# Altium schematic sheet Float_Receiver_PCB.SchDoc
size A3; SheetNumber: 1; SheetTotal: 1
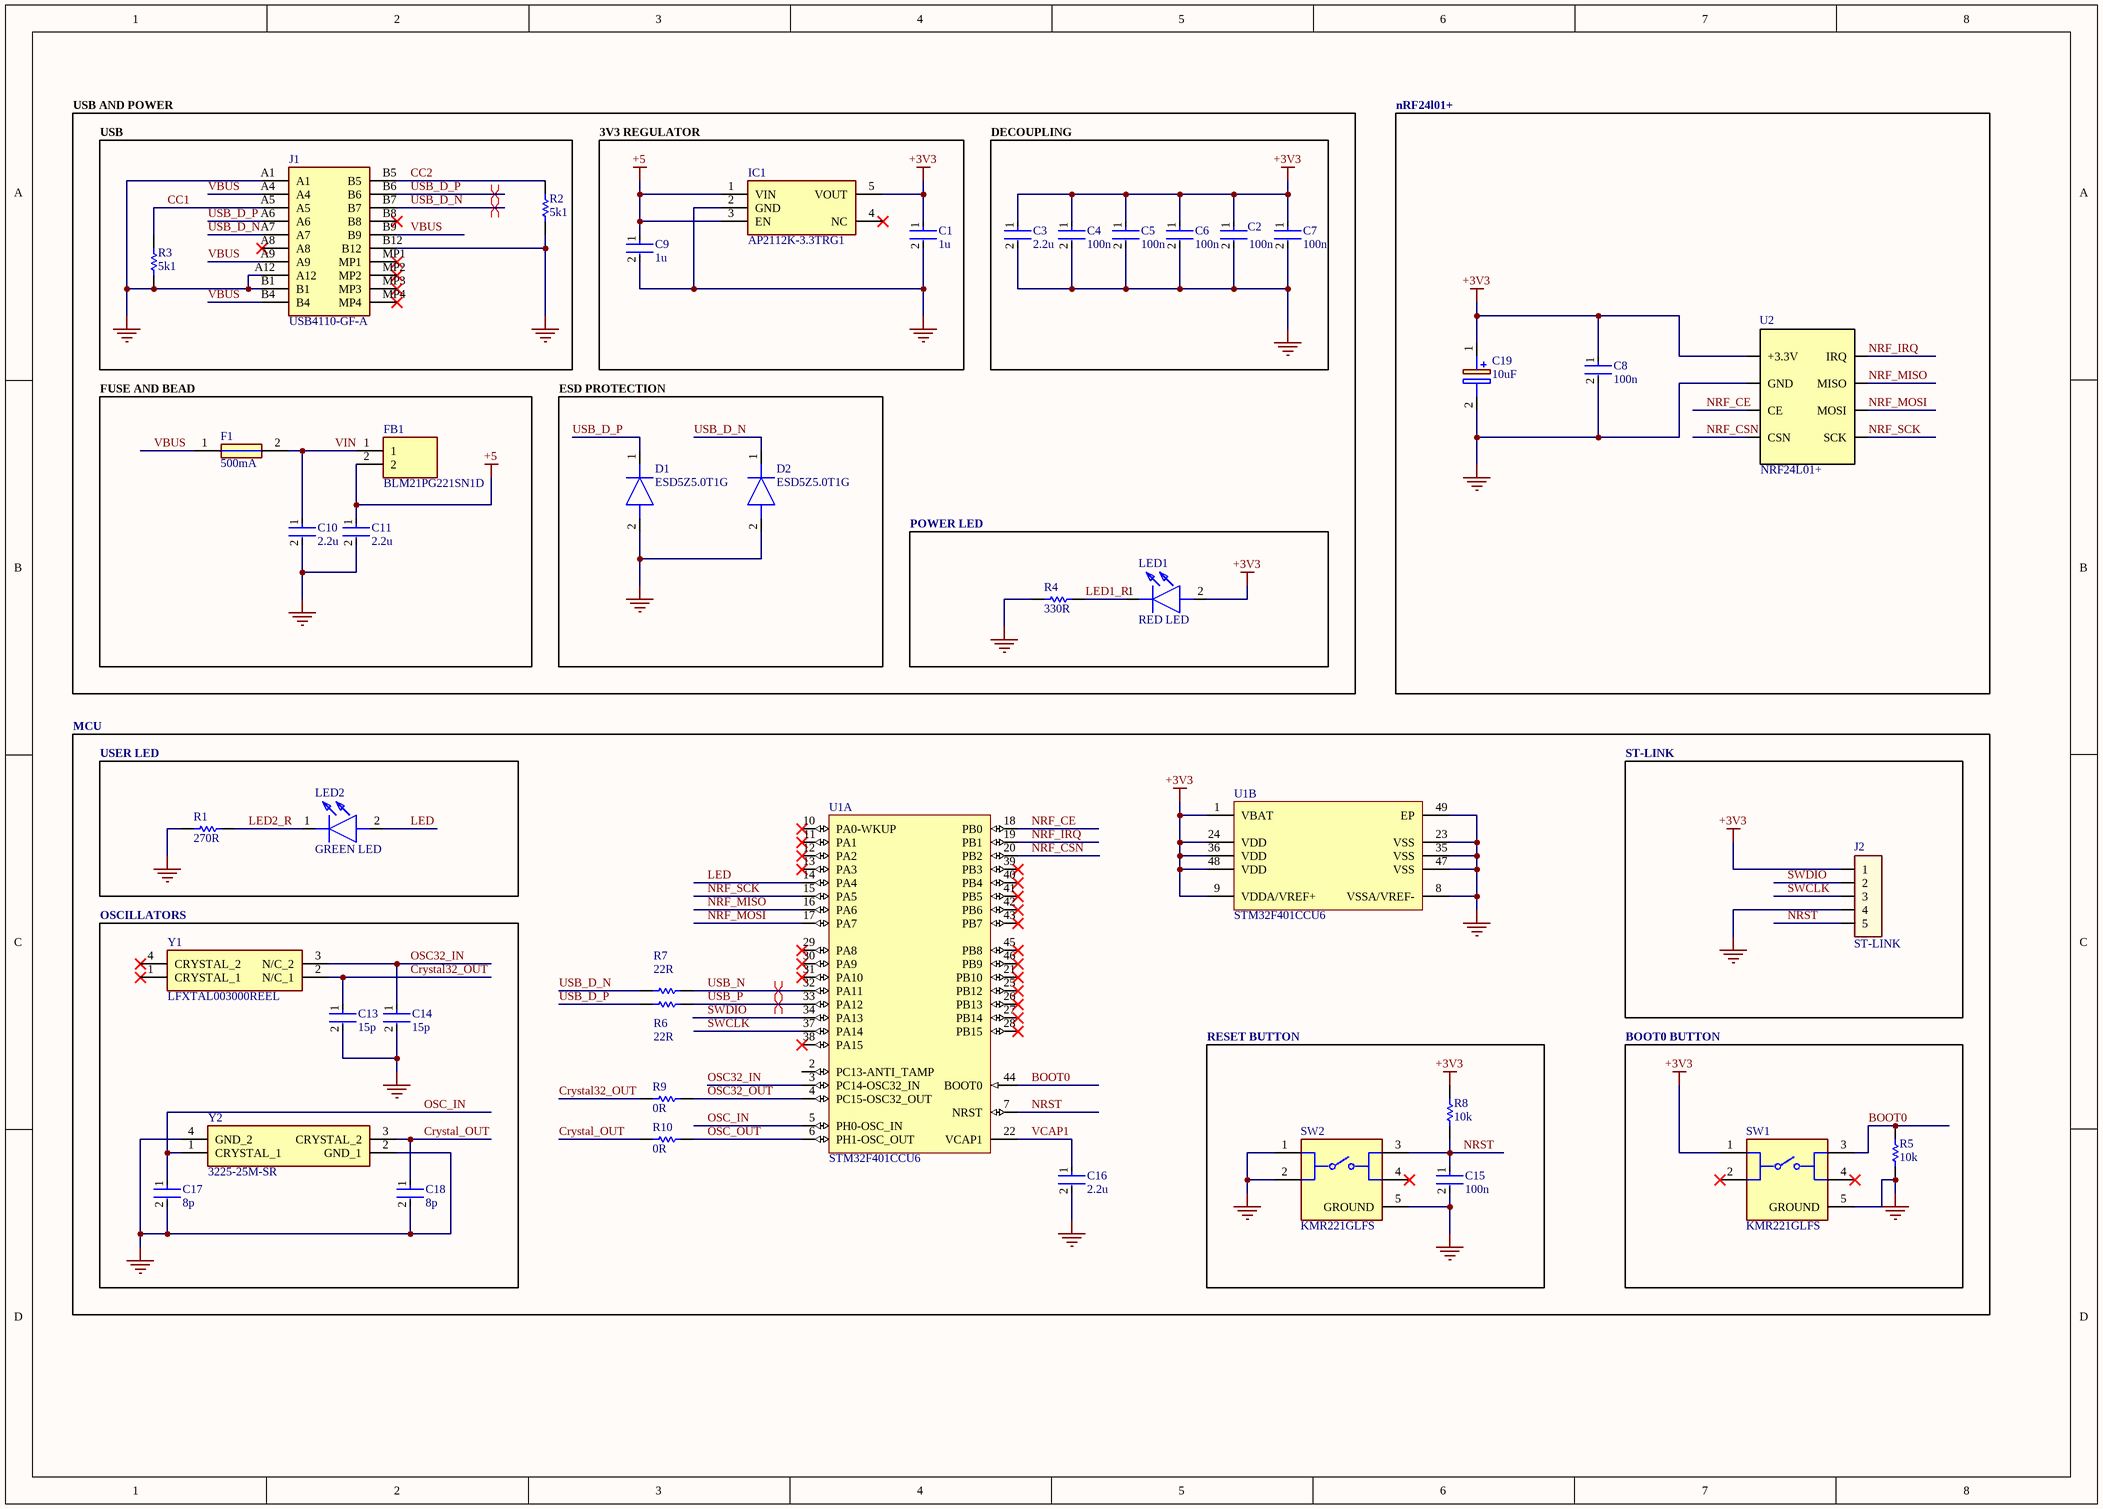
[diagram p0: Float_Receiver_PCB.SchDoc]

## Parts
C1  1u  [FP-0805-L_2_01_0_2-W_1_25-MFG]
C2  100n  [FP-0805-L_2_01_0_2-W_1_25-MFG]
C3  2.2u  [FP-0805-L_2_01_0_2-W_1_25-MFG]
C4  100n  [FP-0805-L_2_01_0_2-W_1_25-MFG]
C5  100n  [FP-0805-L_2_01_0_2-W_1_25-MFG]
C6  100n  [FP-0805-L_2_01_0_2-W_1_25-MFG]
C7  100n  [FP-0805-L_2_01_0_2-W_1_25-MFG]
C8  100n  [FP-0805-L_2_01_0_2-W_1_25-MFG]
C9  1u  [FP-0805-L_2_01_0_2-W_1_25-MFG]
C10  2.2u  [FP-0805-L_2_01_0_2-W_1_25-MFG]
C11  2.2u  [FP-0805-L_2_01_0_2-W_1_25-MFG]
C13  15p  [FP-0805-L_2_01_0_2-W_1_25-MFG]
C14  15p  [FP-0805-L_2_01_0_2-W_1_25-MFG]
C15  100n  [FP-0805-L_2_01_0_2-W_1_25-MFG]
C16  2.2u  [FP-0805-L_2_01_0_2-W_1_25-MFG]
C17  8p  [FP-0805-L_2_01_0_2-W_1_25-MFG]
C18  8p  [FP-0805-L_2_01_0_2-W_1_25-MFG]
C19  10uF  [EEE1AA220WR]
D1  ESD5Z5.0T1G  [SODFL1608X70N]
D2  ESD5Z5.0T1G  [SODFL1608X70N]
F1  500mA  [FUSC3216X75N]
FB1  BLM21PG221SN1D  [BEADC2012X105N]
IC1  AP2112K-3.3TRG1  [SOT95P285X140-5N]
J1  USB4110-GF-A  [USB4110GFA]
J2  ST-LINK  [goldpin5]
LED1  RED LED  [LEDC2012X80N]
LED2  GREEN LED  [LEDC2012X80N]
R1  270R  [RESC2013X60X35ML10T20]
R2  5k1  [RESC2013X60X35ML10T20]
R3  5k1  [RESC2013X60X35ML10T20]
R4  330R  [RESC2013X60X35ML10T20]
R5  10k  [RESC2013X60X35ML10T20]
R6  22R  [RESC2013X60X35ML10T20]
R7  22R  [RESC2013X60X35ML10T20]
R8  10k  [RESC2013X60X35ML10T20]
R9  0R  [RESC2013X60X35ML10T20]
R10  0R  [RESC2013X60X35ML10T20]
SW1  KMR221GLFS  [FP-KMR221GLFS-MFG]
SW2  KMR221GLFS  [FP-KMR221GLFS-MFG]
U1  STM32F401CCU6  [STM-UFQFPN48_N]  (parts A,B of 2)
U2  NRF24L01+ SMD  [PCBComponent_1]  (value not drawn)
Y1  LFXTAL003000REEL  [LFXTAL003000REEL]
Y2  3225-25M-SR  [322525MSR]

## Blocks framed on the sheet
nRF24l01+: C8 C19 U2
USB: J1 R2 R3
3V3 REGULATOR: C1 C9 IC1
DECOUPLING: C2-C7
FUSE AND BEAD: C10 C11 F1 FB1
ESD PROTECTION: D1 D2
POWER LED: LED1 R4
MCU: C16 R6 R7 R9 R10 U1
USER LED: LED2 R1
ST-LINK: J2
OSCILLATORS: C13 C14 C17 C18 Y1 Y2
RESET BUTTON: C15 R8 SW2
BOOT0 BUTTON: R5 SW1

## Nets
+3V3: C1.1 C2.1 C3.1 C4.1 C5.1 C6.1 C7.1 C8.1 C19.1(+) IC1.5(VOUT) J2.1 LED1.2(A) R8.2 SW1.1 U1.1(VBAT) U1.9(VDDA/VREF+) U1.24(VDD) U1.36(VDD) U1.48(VDD) U2.1(+3.3V)
+5: C9.1 C11.1 FB1.2 IC1.1(VIN) IC1.3(EN)
GND: C1.2 C2.2 C3.2 C4.2 C5.2 C6.2 C7.2 C8.2 C9.2 C10.2 C11.2 C13.2 C14.2 C15.2 C16.2 C17.2 C18.2 C19.2(-) D1.2(A) D2.2(A) IC1.2(GND) J1.A1 J1.A12 J1.B1 J1.B12 J2.4 R1.1 R2.1 R3.1 R4.1 R5.2 SW1.5(GROUND) SW2.1 SW2.2 SW2.5(GROUND) U1.8(VSSA/VREF-) U1.23(VSS) U1.35(VSS) U1.47(VSS) U1.49(EP) U2.2(GND) Y2.2(GND_1) Y2.4(GND_2)
BOOT0: R5.1 SW1.3 U1.44(BOOT0)
CC1: J1.A5 R3.2
CC2: J1.B5 R2.2
Crystal32_OUT: C13.1 R9.1 Y1.2(N/C_1)
Crystal_OUT: C18.1 R10.2 Y2.3(CRYSTAL_2)
LED: LED2.2(A) U1.14(PA4)
LED1_R: LED1.1(K) R4.2
LED2_R: LED2.1(K) R1.2
NRF_CE: U1.18(PB0) U2.3(CE)
NRF_CSN: U1.20(PB2) U2.4(CSN)
NRF_IRQ: U1.19(PB1) U2.8(IRQ)
NRF_MISO: U1.16(PA6) U2.7(MISO)
NRF_MOSI: U1.17(PA7) U2.6(MOSI)
NRF_SCK: U1.15(PA5) U2.5(SCK)
NRST: C15.1 J2.5 R8.1 SW2.3 U1.7(NRST)
OSC32_IN: C14.1 U1.3(PC14-OSC32_IN) Y1.3(N/C_2)
OSC32_OUT: R9.2 U1.4(PC15-OSC32_OUT)
OSC_IN: C17.1 U1.5(PH0-OSC_IN) Y2.1(CRYSTAL_1)
OSC_OUT: R10.1 U1.6(PH1-OSC_OUT)
SWCLK: J2.3 U1.37(PA14)
SWDIO: J2.2 U1.34(PA13)
USB_D_N: D2.1(K) J1.A7 J1.B7 R7.2
USB_D_P: D1.1(K) J1.A6 J1.B6 R6.2
USB_N: R7.1 U1.32(PA11)
USB_P: R6.1 U1.33(PA12)
VBUS: F1.1 J1.A4 J1.A9 J1.B4 J1.B9
VCAP1: C16.1 U1.22(VCAP1)
VIN: C10.1 F1.2 FB1.1

Not connected (* = marked no-connect by the designer): IC1 4(NC)*; J1 A8* B8* MP1* MP2* MP3* MP4*; SW1 2* 4*; SW2 4*; U1 2(PC13-ANTI_TAMP) 10(PA0-WKUP)* 11(PA1)* 12(PA2)* 13(PA3)* 21(PB10)* 25(PB12)* 26(PB13)* 27(PB14)* 28(PB15)* 29(PA8)* 30(PA9)* 31(PA10)* 38(PA15)* 39(PB3)* 40(PB4)* 41(PB5)* 42(PB6)* 43(PB7)* 45(PB8)* 46(PB9)*; Y1 1(CRYSTAL_1)* 4(CRYSTAL_2)*

## Layout directives
differential pair: USB_D_N, USB_D_P, USB_N, USB_P

## Notes on the sheet
- USB AND POWER
- (in symbol NRF24L01+ SMD) NRF24L01+

## Library data of the parts
C1 C9 C13 C14 C16-C18 = CMP-1036-04738-3: Voltage Rating: 10V; Tolerance: 10%; Capacitance: 100n; Dissipation Factor: 5%; Dielectric: X7R; Insulation Resistance: 100GR; RoHS Compliant: Yes; Case/Package: 0805; Termination: SMD/SMT; Contact Plating: Tin; Package Quantity: 1; Packaging: Tape and Reel; Series: -; Depth: 1.25mm; Number of Pins: 2; Construction: Flat; Mount: Surface Mount; Voltage: 10V; Radiation Hardening: No; Case Code (Metric): 2012; Case Code (Imperial): 0805; Height: 1.4mm; Thickness: 0.055inch; REACH SVHC: No SVHC; Size: 1.4mm; Max Operating Temperature: 125°C; Lead Free: Lead Free; Length: 2.01mm; Voltage Rating (DC): 10V; Min Operating Temperature: -55°C; Width: 1.25mm
C2-C8 C10 C11 C15 = CMP-1036-04738-3: Voltage Rating: 10V; Tolerance: 10%; Dissipation Factor: 5%; Dielectric: X7R; Insulation Resistance: 100GR; RoHS Compliant: Yes; Case/Package: 0805; Termination: SMD/SMT; Contact Plating: Tin; Package Quantity: 1; Packaging: Tape and Reel; Series: -; Depth: 1.25mm; Number of Pins: 2; Construction: Flat; Mount: Surface Mount; Voltage: 10V; Radiation Hardening: No; Case Code (Metric): 2012; Case Code (Imperial): 0805; Height: 1.4mm; Thickness: 0.055inch; REACH SVHC: No SVHC; Size: 1.4mm; Max Operating Temperature: 125°C; Lead Free: Lead Free; Length: 2.01mm; Voltage Rating (DC): 10V; Min Operating Temperature: -55°C; Width: 1.25mm
  C2 C4-C8 C15: Capacitance: 100n
  C3 C10 C11: Capacitance: 2.2u
C19 = EEE1CA100SR: Capacitor Polarised; Manufacturer_Name: Panasonic; Datasheet Link: http://industrial.panasonic.com/cdbs/www-data/pdf/RDE0000/ABA0000C1145.pdf; Height: 5.5mm; Manufacturer_Part_Number: EEE1CA100SR; Arrow Part Number: EEE1CA100SR; Arrow Price/Stock: https://www.arrow.com/en/products/eee-1ca100sr/panasonic
D1 D2 = ESD5Z5.0T1G: Diode; Manufacturer_Name: onsemi; Datasheet Link: https://www.onsemi.com/pub/Collateral/ESD5Z2.5T1-D.PDF; Height: 0.7mm; Manufacturer_Part_Number: ESD5Z5.0T1G; Mouser Part Number: 863-ESD5Z5.0T1G; Mouser Price/Stock: https://www.mouser.co.uk/ProductDetail/onsemi/ESD5Z5.0T1G?qs=OSf9jACorvYw3fDx1S8P6A%3D%3D; Arrow Part Number: ESD5Z5.0T1G; Arrow Price/Stock: https://www.arrow.com/en/products/esd5z5.0t1g/on-semiconductor?utm_currency=USD&region=nac
F1 = 0ZCJ0025FF2E: Fuse; Manufacturer_Name: Bel Circuit Protection; Datasheet Link: https://componentsearchengine.com/Datasheets/2/0ZCJ0025FF2E.pdf; Height: 0.75mm; Manufacturer_Part_Number: 0ZCJ0025FF2E; Arrow Part Number: 0ZCJ0025FF2E; Arrow Price/Stock: https://www.arrow.com/en/products/0zcj0025ff2e/bel-group?region=nac
FB1 = BLM21PG221SN1D: Ferrite Bead; Manufacturer_Name: Murata Electronics; Datasheet Link: https://datasheet.datasheetarchive.com/originals/dk/DKDS-31/605570.pdf; Height: 1.05mm; Manufacturer_Part_Number: BLM21PG221SN1D; Mouser Part Number: 81-BLM21P221SG; Mouser Price/Stock: https://www.mouser.co.uk/ProductDetail/Murata-Electronics/BLM21PG221SN1D?qs=N%2FLoXOA9PTJ4i6RHFrsqmw%3D%3D; Arrow Part Number: BLM21PG221SN1D; Arrow Price/Stock: https://www.arrow.com/en/products/blm21pg221sn1d/murata-manufacturing?utm_currency=USD&region=europe
IC1 = AP2112K-3.3TRG1: Integrated Circuit; Manufacturer_Name: Diodes Incorporated; Datasheet Link: https://www.diodes.com//assets/Datasheets/AP2112.pdf; Height: 1.4mm; Manufacturer_Part_Number: AP2112K-3.3TRG1; Mouser Part Number: 621-AP2112K-3.3TRG1; Mouser Price/Stock: https://www.mouser.co.uk/ProductDetail/Diodes-Incorporated/AP2112K-3.3TRG1?qs=x6A8l6qLYDDPYHosCdzh%2FA%3D%3D; Arrow Part Number: AP2112K-3.3TRG1; Arrow Price/Stock: https://www.arrow.com/en/products/ap2112k-3.3trg1/diodes-incorporated?utm_currency=USD&region=nac
J1 = USB4110-GF-A: Connector; Manufacturer_Name: GCT (GLOBAL CONNECTOR TECHNOLOGY); Datasheet Link: https://gct.co/files/drawings/usb4110.pdf; Height: 3.26mm; Manufacturer_Part_Number: USB4110-GF-A; Mouser Part Number: 640-USB4110-GF-A; Mouser Price/Stock: https://www.mouser.co.uk/ProductDetail/GCT/USB4110-GF-A?qs=KUoIvG%2F9IlYiZvIXQjyJeA%3D%3D
J2 = goldpin_5
LED1 LED2 = HSMG-C170: LED; Manufacturer_Name: Avago Technologies; Datasheet Link: https://datasheet.datasheetarchive.com/originals/distributors/SFDatasheet-4/sf-00083853.pdf; Height: 0.8mm; Manufacturer_Part_Number: HSMG-C170; Mouser Part Number: 630-HSMG-C170; Mouser Price/Stock: https://www.mouser.co.uk/ProductDetail/Broadcom-Avago/HSMG-C170?qs=YDL0qNrpDT4lm8ArMPkMEA%3D%3D
R1-R10 = CMP-2100-03671-1: Manufacturer: Yageo; Temperature Coefficient: 100ppm/degreesC; Voltage Rating (DC): 150V; Max Power Dissipation: 125mW; Resistance: 1KOhm; Tolerance: 1%; Number of Pins: 2; Number of Terminations: 2; Datasheet URL: http://www.yageo.com/NewPortal/yageodocoutput?fileName=/pdf/R-Chip/PYu-RC_Group_51_RoHS_L_5.pdf; Length: 0.079inch; Package Description: 2-Pin Surface Mounted Device, Body 2 x 1.25 mm; Depth: 1.25mm; Height: 0.024inch; Military Standard: Not; Case/Package: 0805; Package Reference: 0805; RoHSCompliant: true; Lead Free: LeadFree; Packaging: TapeandReel; Package Quantity: 1; Datasheet Version: Rev. 5, 10/2016; Min Operating Temperature: -55degC; Voltage Rating: 150V; Composition: ThickFilm; Case Code (Imperial): 0805; Power Rating: 125mW; Width: 0.049inch; Case Code (Metric): 2012; Manufacturer URL: http://www.yageo.com/; Max Operating Temperature: 155degC; REACH SVHC: Unknown; Termination: SMD/SMT
SW1 SW2 = CMP-10040-000018-1: SWITCH TACTILE SPST-NO 0.05A 32V; Illumination Type: Non-Illuminated; Contact Resistance: 100mR; Power Rating: 1W; Actuator Type: Standard; Operating Force: 2N; Max Current Rating: 50mA; Switch Function: Off-Mom; Switch Travel: 0.25mm; Actuator Length: 0.5mm; Mechanical Life: 200000Cycles; Throw Configuration: SPST; Length: 2.8mm; Max Voltage Rating (DC): 32V; Depth: 4.6mm; Orientation: Straight; Max Operating Temperature: 85°C; Packaging: Tape and Reel; Voltage Rating (DC): 32V; Width: 2.8mm; Termination: Gull Wing; Contact Plating: Silver; Case/Package: SMD/SMT; Contact Current Rating: 50mA; Mount: Surface Mount; Current Rating: 50mA; REACH SVHC: No SVHC; Lead Free: Lead Free; Radiation Hardening: No; Package Quantity: 1; Contact Material: Silver; Min Operating Temperature: -40°C
U1 = CMP-0243-00119-2: ARM Cortex-M4 32-bit MCU+FPU, 105 DMIPS, 256 kB Flash, 64 kB Internal RAM, 36 I/Os, 48-pin UFQFPN, -40 to 85 degC, Tray; Manufacturer: STMicroelectronics; Supply Voltage(Vcc) max (V): 3.6; I/Os (High Current): 36; Internal RAM Size (kB): 64; Operating Frequency(F) (Processor speed) (MHz): 84; FLASH Size (Prog) (kB): 256; Supply Voltage(Vcc) min (V): 1.8; Packing: Tray; PackageReference: UFQFPN48; PackageVersion: Rev. 1, 04/2013; Core: ARM Cortex-M4; ComponentLink1Description: Manufacturer URL; ComponentLink3Description: Package Specification; PackageDescription: 48-Pin Ultra Thin Fine Pitch Quad Flat No-Lead, 7 x 7 x 0.6 mm Body, 0.5 mm Pitch, Exposed Pad; Mounting Technology: Surface Mount; ComponentLink2URL: http://www.st.com/st-web-ui/static/active/en/resource/technical/document/data_brief/DM00071938.pdf; DatasheetVersion: Rev. 1; ComponentLink2Description: Datasheet; ComponentLink1URL: http://www.st.com/web/en/home.html; PartNumber: STM32F401CCU6; ComponentLink3URL: http://www.st.com/st-web-ui/static/active/en/resource/technical/document/data_brief/DM00071938.pdf
Y1 = LFXTAL003000REEL: Crystal or Oscillator; Manufacturer_Name: IQD; Datasheet Link: https://www.iqdfrequencyproducts.com/products/pn/LFXTAL003000.pdf; Height: 2.5mm; Manufacturer_Part_Number: LFXTAL003000REEL; Mouser Part Number: 449-LFXTAL003000REEL; Mouser Price/Stock: https://www.mouser.co.uk/ProductDetail/IQD/LFXTAL003000Reel?qs=GJ%2F2ZGcr5uOHwN9t8Hha8Q%3D%3D; Arrow Part Number: LFXTAL003000REEL; Arrow Price/Stock: https://www.arrow.com/en/products/lfxtal003000reel/iqd-frequency-products?region=europe
Y2 = 3225-25M-SR: Crystal or Oscillator; Manufacturer_Name: SRPASSIVES; Datasheet Link: https://www.tme.eu/Document/9cb2d0edad968d8543e7bc99995fd180/3235.pdf; Height: 0.7mm; Manufacturer_Part_Number: 3225-25M-SR